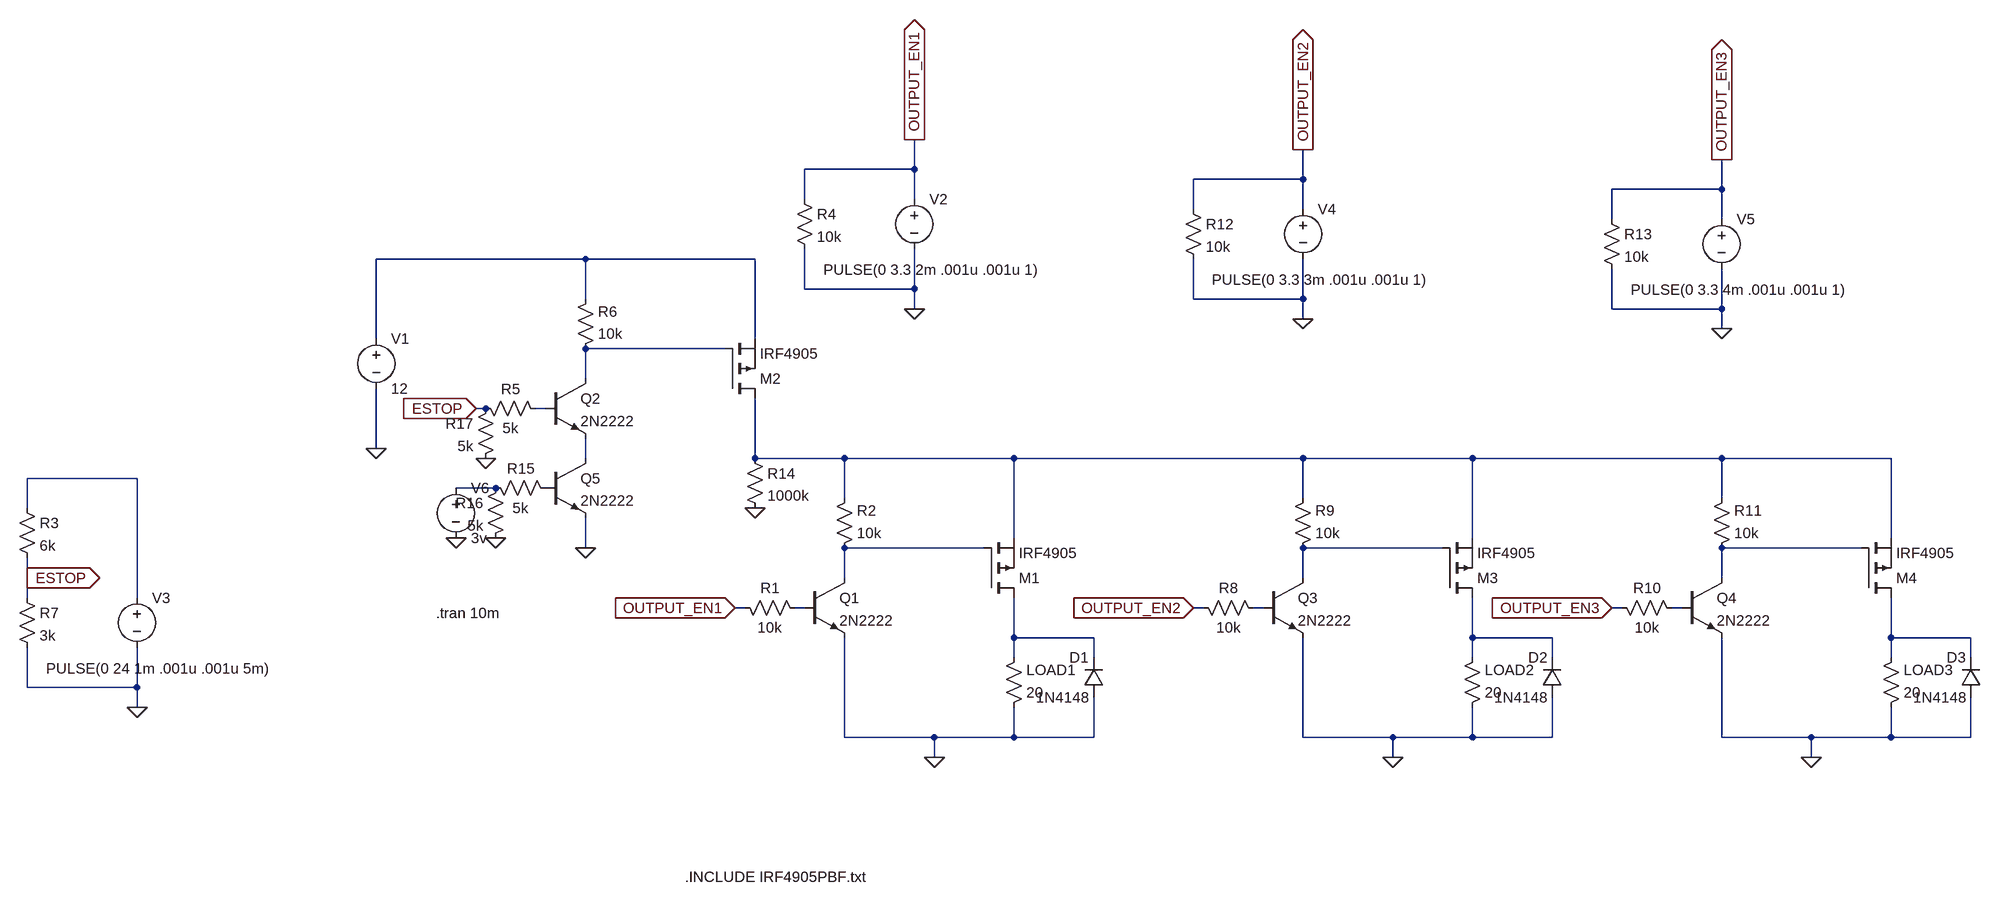
[diagram p0: schematic output_ckt.asc]
output_ckt.asc, the LTspice schematic file:
Version 4
SHEET 1 3092 680
WIRE 480 -608 480 -656
WIRE 480 -608 304 -608
WIRE 1104 -592 1104 -640
WIRE 1104 -592 928 -592
WIRE 1776 -576 1776 -624
WIRE 1776 -576 1600 -576
WIRE 304 -560 304 -608
WIRE 480 -560 480 -608
WIRE 928 -544 928 -592
WIRE 1104 -544 1104 -592
WIRE 1600 -528 1600 -576
WIRE 1776 -528 1776 -576
WIRE -48 -464 -384 -464
WIRE 224 -464 -48 -464
WIRE 304 -416 304 -480
WIRE 480 -416 480 -480
WIRE 480 -416 304 -416
WIRE -48 -400 -48 -464
WIRE 928 -400 928 -464
WIRE 1104 -400 1104 -464
WIRE 1104 -400 928 -400
WIRE 480 -384 480 -416
WIRE 1600 -384 1600 -448
WIRE 1776 -384 1776 -448
WIRE 1776 -384 1600 -384
WIRE 1104 -368 1104 -400
WIRE 1776 -352 1776 -384
WIRE -384 -336 -384 -464
WIRE 224 -336 224 -464
WIRE 176 -320 -48 -320
WIRE -48 -272 -48 -320
WIRE -208 -224 -224 -224
WIRE -112 -224 -128 -224
WIRE -384 -160 -384 -256
WIRE -48 -144 -48 -176
WIRE 224 -144 224 -240
WIRE 368 -144 224 -144
WIRE 640 -144 368 -144
WIRE 1104 -144 640 -144
WIRE 1376 -144 1104 -144
WIRE 1776 -144 1376 -144
WIRE 2048 -144 1776 -144
WIRE -768 -112 -944 -112
WIRE -192 -96 -256 -96
WIRE 368 -80 368 -144
WIRE 1104 -80 1104 -144
WIRE 1776 -80 1776 -144
WIRE -944 -64 -944 -112
WIRE 640 -16 640 -144
WIRE 1376 -16 1376 -144
WIRE 2048 -16 2048 -144
WIRE -48 0 -48 -48
WIRE 592 0 368 0
WIRE 1328 0 1104 0
WIRE 2000 0 1776 0
WIRE -944 48 -944 16
WIRE 368 48 368 0
WIRE 1104 48 1104 0
WIRE 1776 48 1776 0
WIRE -944 80 -944 48
WIRE -768 80 -768 -112
WIRE 208 96 192 96
WIRE 304 96 288 96
WIRE 944 96 928 96
WIRE 1040 96 1024 96
WIRE 1616 96 1600 96
WIRE 1712 96 1696 96
WIRE 640 144 640 80
WIRE 768 144 640 144
WIRE 1376 144 1376 80
WIRE 1504 144 1376 144
WIRE 2048 144 2048 80
WIRE 2176 144 2048 144
WIRE 640 176 640 144
WIRE 768 176 768 144
WIRE 1376 176 1376 144
WIRE 1504 176 1504 144
WIRE 2048 176 2048 144
WIRE 2176 176 2176 144
WIRE -944 224 -944 160
WIRE -768 224 -768 160
WIRE -768 224 -944 224
WIRE -768 256 -768 224
WIRE 368 304 368 144
WIRE 512 304 368 304
WIRE 640 304 640 256
WIRE 640 304 512 304
WIRE 768 304 768 240
WIRE 768 304 640 304
WIRE 1104 304 1104 144
WIRE 1248 304 1104 304
WIRE 1376 304 1376 256
WIRE 1376 304 1248 304
WIRE 1504 304 1504 240
WIRE 1504 304 1376 304
WIRE 1776 304 1776 144
WIRE 1920 304 1776 304
WIRE 2048 304 2048 256
WIRE 2048 304 1920 304
WIRE 2176 304 2176 240
WIRE 2176 304 2048 304
WIRE 512 336 512 304
WIRE 1248 336 1248 304
WIRE 1920 336 1920 304
FLAG 512 336 0
FLAG 480 -384 0
FLAG 480 -656 OUTPUT_EN1
IOPIN 480 -656 Out
FLAG -384 -160 0
FLAG 192 96 OUTPUT_EN1
IOPIN 192 96 In
FLAG -768 256 0
FLAG -944 48 ESTOP
IOPIN -944 48 Out
FLAG -224 -224 ESTOP
IOPIN -224 -224 In
FLAG -48 0 0
FLAG 1248 336 0
FLAG 928 96 OUTPUT_EN2
IOPIN 928 96 In
FLAG 1920 336 0
FLAG 1600 96 OUTPUT_EN3
IOPIN 1600 96 In
FLAG 1104 -368 0
FLAG 1104 -640 OUTPUT_EN2
IOPIN 1104 -640 Out
FLAG 1776 -352 0
FLAG 1776 -624 OUTPUT_EN3
IOPIN 1776 -624 Out
FLAG 224 -64 0
FLAG -256 -16 0
FLAG -208 -144 0
FLAG -192 -16 0
SYMBOL voltage -384 -352 R0
WINDOW 123 0 0 Left 0
WINDOW 39 0 0 Left 0
SYMATTR InstName V1
SYMATTR Value 12
SYMBOL res 192 80 M90
WINDOW 0 0 56 VBottom 2
WINDOW 3 32 56 VTop 2
SYMATTR InstName R1
SYMATTR Value 10k
SYMBOL res 352 16 M180
WINDOW 0 36 76 Left 2
WINDOW 3 36 40 Left 2
SYMATTR InstName R2
SYMATTR Value 10k
SYMBOL res 624 272 M180
WINDOW 0 36 76 Left 2
WINDOW 3 36 40 Left 2
SYMATTR InstName LOAD1
SYMATTR Value 20
SYMBOL npn 304 48 R0
SYMATTR InstName Q1
SYMATTR Value 2N2222
SYMBOL pmos 592 80 M180
SYMATTR InstName M1
SYMATTR Value IRF4905
SYMATTR Prefix X
SYMBOL voltage 480 -576 R0
WINDOW 3 -146 129 Left 2
WINDOW 123 0 0 Left 0
WINDOW 39 0 0 Left 0
SYMATTR Value PULSE(0 3.3 2m .001u .001u 1)
SYMATTR InstName V2
SYMBOL res 288 -576 R0
SYMATTR InstName R4
SYMATTR Value 10k
SYMBOL voltage -768 64 R0
WINDOW 3 -146 129 Left 2
WINDOW 123 0 0 Left 0
WINDOW 39 0 0 Left 0
SYMATTR Value PULSE(0 24 1m .001u .001u 5m)
SYMATTR InstName V3
SYMBOL res -224 -240 M90
WINDOW 0 0 56 VBottom 2
WINDOW 3 32 56 VTop 2
SYMATTR InstName R5
SYMATTR Value 5k
SYMBOL res -64 -304 M180
WINDOW 0 36 76 Left 2
WINDOW 3 36 40 Left 2
SYMATTR InstName R6
SYMATTR Value 10k
SYMBOL npn -112 -272 R0
SYMATTR InstName Q2
SYMATTR Value 2N2222
SYMBOL pmos 176 -240 M180
SYMATTR InstName M2
SYMATTR Value IRF4905
SYMATTR Prefix X
SYMBOL res -960 -80 R0
SYMATTR InstName R3
SYMATTR Value 6k
SYMBOL res -960 64 R0
SYMATTR InstName R7
SYMATTR Value 3k
SYMBOL res 928 80 M90
WINDOW 0 0 56 VBottom 2
WINDOW 3 32 56 VTop 2
SYMATTR InstName R8
SYMATTR Value 10k
SYMBOL res 1088 16 M180
WINDOW 0 36 76 Left 2
WINDOW 3 36 40 Left 2
SYMATTR InstName R9
SYMATTR Value 10k
SYMBOL res 1360 272 M180
WINDOW 0 36 76 Left 2
WINDOW 3 36 40 Left 2
SYMATTR InstName LOAD2
SYMATTR Value 20
SYMBOL npn 1040 48 R0
SYMATTR InstName Q3
SYMATTR Value 2N2222
SYMBOL pmos 1328 80 M180
SYMATTR InstName M3
SYMATTR Value IRF4905
SYMATTR Prefix X
SYMBOL res 1600 80 M90
WINDOW 0 0 56 VBottom 2
WINDOW 3 32 56 VTop 2
SYMATTR InstName R10
SYMATTR Value 10k
SYMBOL res 1760 16 M180
WINDOW 0 36 76 Left 2
WINDOW 3 36 40 Left 2
SYMATTR InstName R11
SYMATTR Value 10k
SYMBOL res 2032 272 M180
WINDOW 0 36 76 Left 2
WINDOW 3 36 40 Left 2
SYMATTR InstName LOAD3
SYMATTR Value 20
SYMBOL npn 1712 48 R0
SYMATTR InstName Q4
SYMATTR Value 2N2222
SYMBOL pmos 2000 80 M180
SYMATTR InstName M4
SYMATTR Value IRF4905
SYMATTR Prefix X
SYMBOL voltage 1104 -560 R0
WINDOW 3 -146 129 Left 2
WINDOW 123 0 0 Left 0
WINDOW 39 0 0 Left 0
SYMATTR Value PULSE(0 3.3 3m .001u .001u 1)
SYMATTR InstName V4
SYMBOL res 912 -560 R0
SYMATTR InstName R12
SYMATTR Value 10k
SYMBOL voltage 1776 -544 R0
WINDOW 3 -146 129 Left 2
WINDOW 123 0 0 Left 0
WINDOW 39 0 0 Left 0
SYMATTR Value PULSE(0 3.3 4m .001u .001u 1)
SYMATTR InstName V5
SYMBOL res 1584 -544 R0
SYMATTR InstName R13
SYMATTR Value 10k
SYMBOL res 208 -160 R0
SYMATTR InstName R14
SYMATTR Value 1000k
SYMBOL diode 784 240 R180
WINDOW 0 24 64 Left 2
WINDOW 3 24 0 Left 2
SYMATTR InstName D1
SYMATTR Value 1N4148
SYMBOL diode 1520 240 R180
WINDOW 0 24 64 Left 2
WINDOW 3 24 0 Left 2
SYMATTR InstName D2
SYMATTR Value 1N4148
SYMBOL diode 2192 240 R180
WINDOW 0 24 64 Left 2
WINDOW 3 24 0 Left 2
SYMATTR InstName D3
SYMATTR Value 1N4148
SYMBOL npn -112 -144 R0
SYMATTR InstName Q5
SYMATTR Value 2N2222
SYMBOL Voltage -256 -112 R0
SYMATTR InstName V6
SYMATTR Value 3v
SYMBOL res -208 -112 M90
WINDOW 0 0 56 VBottom 2
WINDOW 3 32 56 VTop 2
SYMATTR InstName R15
SYMATTR Value 5k
SYMBOL res -176 -112 M0
SYMATTR InstName R16
SYMATTR Value 5k
SYMBOL res -192 -240 M0
SYMATTR InstName R17
SYMATTR Value 5k
TEXT 112 528 Left 2 !.INCLUDE IRF4905PBF.txt
TEXT -288 104 Left 2 !.tran 10m

The netlist it stands for:
* output_ckt.asc
V1 N001 0 12
R1 OUTPUT_EN1 N011 10k
R2 N008 N005 10k
R§LOAD1 0 N014 20
Q1 N008 N011 0 0 2N2222
XM1 N014 N008 N005 IRF4905  ; pins D G S
V2 OUTPUT_EN1 0 PULSE(0 3.3 2m .001u .001u 1)
R4 OUTPUT_EN1 0 10k
V3 N006 0 PULSE(0 24 1m .001u .001u 5m)
R5 ESTOP N003 5k
R6 N002 N001 10k
Q2 N002 N003 N004 0 2N2222
XM2 N005 N002 N001 IRF4905  ; pins D G S
R3 N006 ESTOP 6k
R7 ESTOP 0 3k
R8 OUTPUT_EN2 N012 10k
R9 N009 N005 10k
R§LOAD2 0 N015 20
Q3 N009 N012 0 0 2N2222
XM3 N015 N009 N005 IRF4905  ; pins D G S
R10 OUTPUT_EN3 N013 10k
R11 N010 N005 10k
R§LOAD3 0 N016 20
Q4 N010 N013 0 0 2N2222
XM4 N016 N010 N005 IRF4905  ; pins D G S
V4 OUTPUT_EN2 0 PULSE(0 3.3 3m .001u .001u 1)
R12 OUTPUT_EN2 0 10k
V5 OUTPUT_EN3 0 PULSE(0 3.3 4m .001u .001u 1)
R13 OUTPUT_EN3 0 10k
R14 N005 0 1000k
D1 0 N014 1N4148
D2 0 N015 1N4148
D3 0 N016 1N4148
Q5 N004 P001 0 0 2N2222
V6 N007 0 3v
R15 N007 P001 5k
R16 N007 0 5k
R17 ESTOP 0 5k
.model D D
.lib standard.dio
.model NPN NPN
.model PNP PNP
.lib standard.bjt
.INCLUDE IRF4905PBF.txt
.tran 10m
.backanno
.end